# EAGLE schematic samd21g_board (EAGLE 9.6.2)

## Sheet 1 of 2
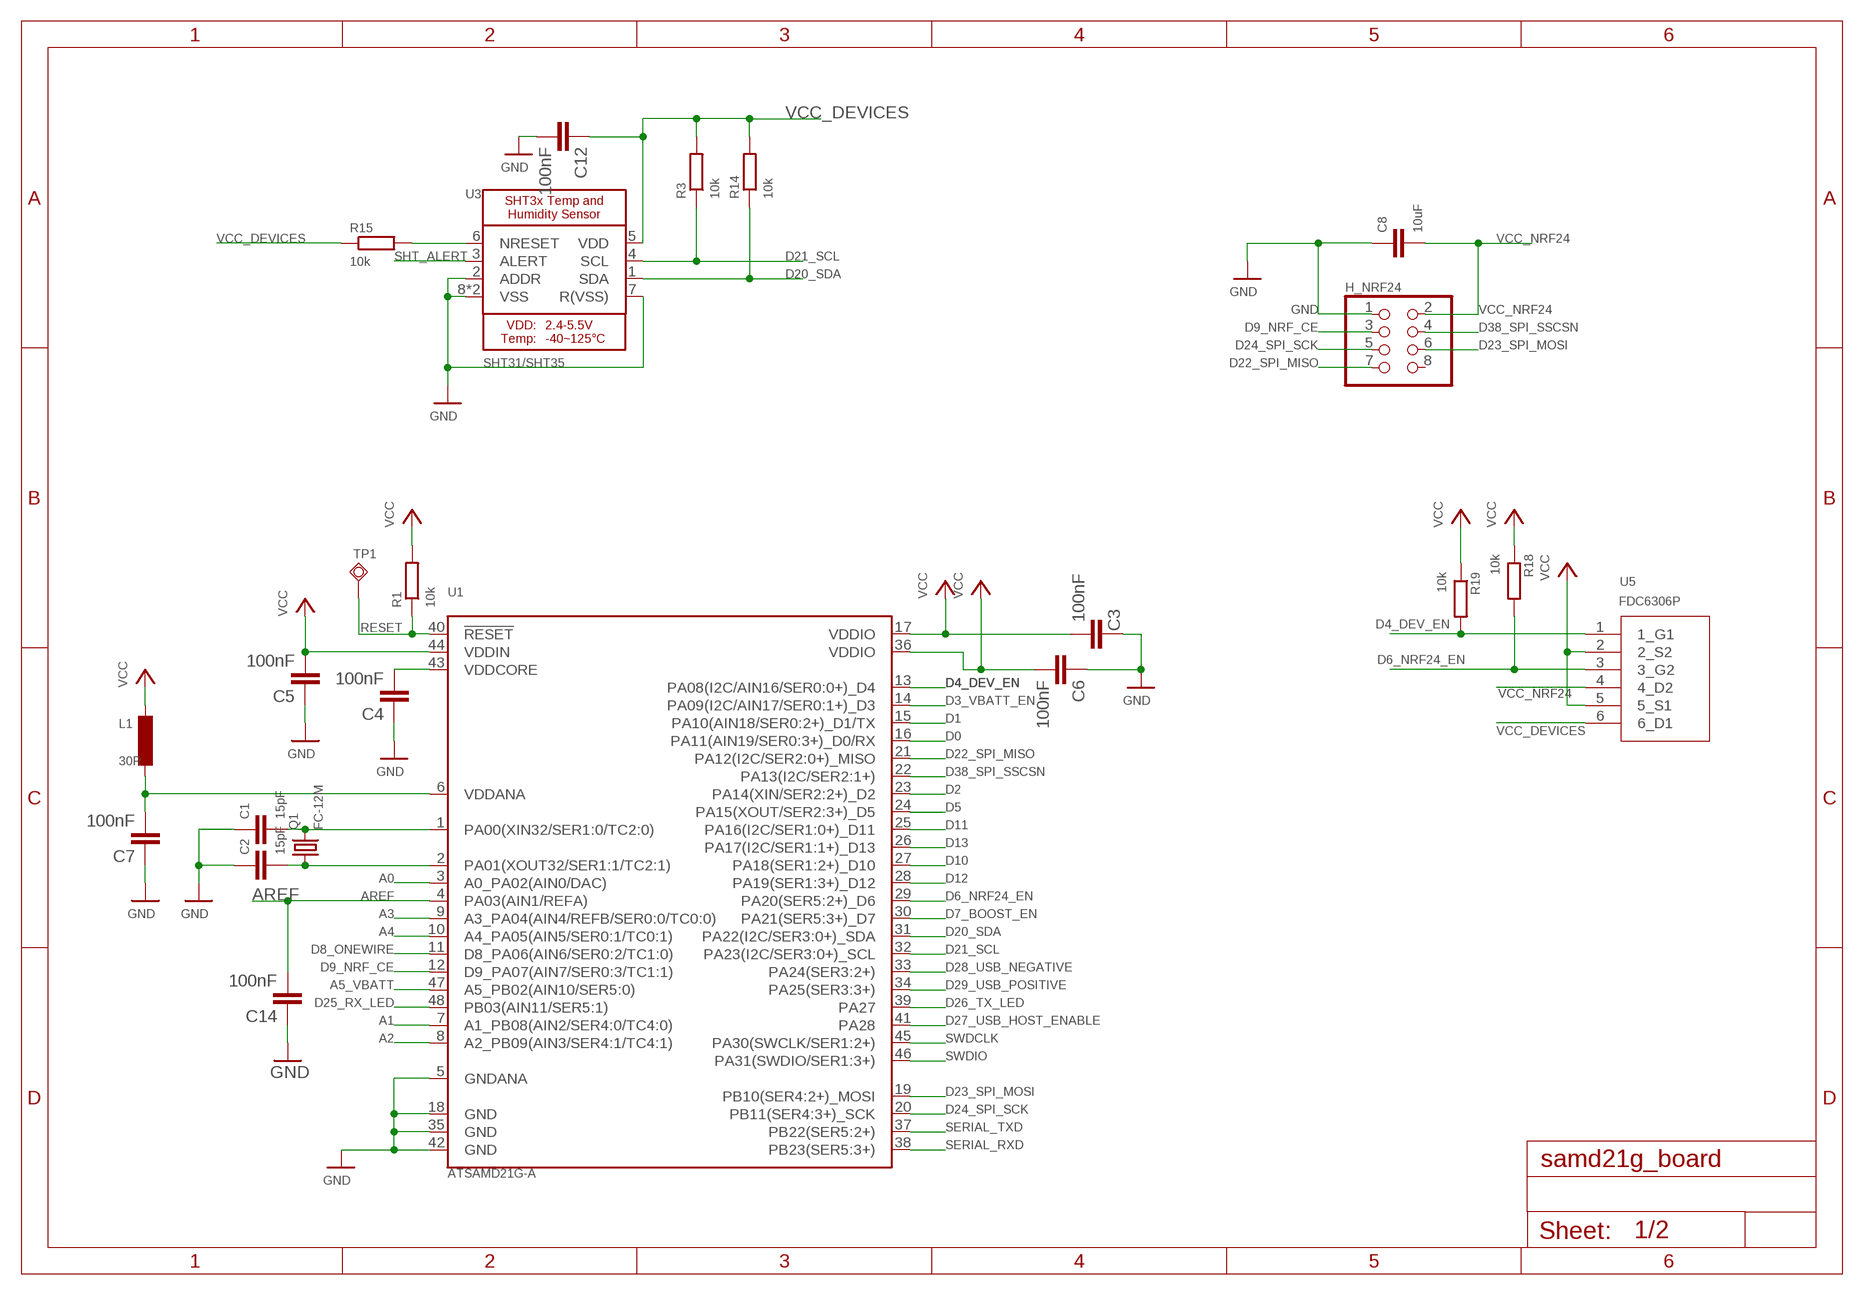
[diagram p0: schematic, sheet 1]

### Parts
C1  15pF  C-EUC0402  [C0402]
C2  15pF  C-EUC0402  [C0402]
C3  100nF  C-EUC0603  [C0603]
C4  100nF  C-EUC0603  [C0603]
C5  100nF  C-EUC0603  [C0603]
C6  100nF  C-EUC0603  [C0603]
C7  100nF  C-EUC0603  [C0603]
C8  10uF  C-EUC0805  [C0805]
C12  100nF  C-EUC0603  [C0603]
C14  100nF  C-EUC0603  [C0603]
H_NRF24  PINHD-2X04_2.54  [2X04]
L1  30R  L-EUL3225M  [L3225M]
Q1  FC-12M  [FC-12M]
R1  10k  R-EU_R0805  [R0805]
R3  10k  R-EU_R0805  [R0805]
R14  10k  R-EU_R0805  [R0805]
R15  10k  R-EU_R0805  [R0805]
R18  10k  R-EU_R0805  [R0805]
R19  10k  R-EU_R0805  [R0805]
TP1  TPSQTP13SQ  [TP13SQ]
U1  ATSAMD21G-A  [TQFP-48]
U3  SHT31/SHT35  SHT3X  [SHT3X_DFN8]
U5  FDC6306P  [TSOT23-6_419BL_ONS]

### Nets
A0: U1.3(A0_PA02(AIN0/DAC)) ; also sheet 2
A1: U1.7(A1_PB08(AIN2/SER4:0/TC4:0)) ; also sheet 2
A2: U1.8(A2_PB09(AIN3/SER4:1/TC4:1)) ; also sheet 2
A3: U1.9(A3_PA04(AIN4/REFB/SER0:0/TC0:0)) ; also sheet 2
A4: U1.10(A4_PA05(AIN5/SER0:1/TC0:1)) ; also sheet 2
A5_VBATT: U1.47(A5_PB02(AIN10/SER5:0)) ; also sheet 2
AREF: C14.2 U1.4(PA03(AIN1/REFA)) ; also sheet 2
D0: U1.16(PA11(AIN19/SER0:3+)_D0/RX) ; also sheet 2
D1: U1.15(PA10(AIN18/SER0:2+)_D1/TX) ; also sheet 2
D2: U1.23(PA14(XIN/SER2:2+)_D2) ; also sheet 2
D3_VBATT_EN: U1.14(PA09(I2C/AIN17/SER0:1+)_D3) ; also sheet 2
D4_DEV_EN: R19.2 U1.13(PA08(I2C/AIN16/SER0:0+)_D4) U5.1(1_G1)
D5: U1.24(PA15(XOUT/SER2:3+)_D5) ; also sheet 2
D6_NRF24_EN: R18.2 U1.29(PA20(SER5:2+)_D6) U5.3(3_G2)
D7_BOOST_EN: U1.30(PA21(SER5:3+)_D7) ; also sheet 2
D8_ONEWIRE: U1.11(D8_PA06(AIN6/SER0:2/TC1:0)) ; also sheet 2
D9_NRF_CE: H_NRF24.3 U1.12(D9_PA07(AIN7/SER0:3/TC1:1))
D10: U1.27(PA18(SER1:2+)_D10) ; also sheet 2
D11: U1.25(PA16(I2C/SER1:0+)_D11) ; also sheet 2
D12: U1.28(PA19(SER1:3+)_D12) ; also sheet 2
D13: U1.26(PA17(I2C/SER1:1+)_D13) ; also sheet 2
D20_SDA: R14.1 U1.31(PA22(I2C/SER3:0+)_SDA) U3.1(SDA) ; also sheet 2
D21_SCL: R3.1 U1.32(PA23(I2C/SER3:0+)_SCL) U3.4(SCL) ; also sheet 2
D22_SPI_MISO: H_NRF24.7 U1.21(PA12(I2C/SER2:0+)_MISO) ; also sheet 2
D23_SPI_MOSI: H_NRF24.6 U1.19(PB10(SER4:2+)_MOSI) ; also sheet 2
D24_SPI_SCK: H_NRF24.5 U1.20(PB11(SER4:3+)_SCK) ; also sheet 2
D25_RX_LED: U1.48(PB03(AIN11/SER5:1)) ; also sheet 2
D26_TX_LED: U1.39(PA27) ; also sheet 2
D27_USB_HOST_ENABLE: U1.41(PA28) ; also sheet 2
D28_USB_NEGATIVE: U1.33(PA24(SER3:2+)) ; also sheet 2
D29_USB_POSITIVE: U1.34(PA25(SER3:3+)) ; also sheet 2
D38_SPI_SSCSN: H_NRF24.4 U1.22(PA13(I2C/SER2:1+)) ; also sheet 2
GND [vcc]: C1.1 C2.1 C3.1 C4.1 C5.1 C6.1 C7.1 C8.1 C12.2 C14.1 H_NRF24.1 U1.5(GNDANA) U1.18(GND) U1.35(GND) U1.42(GND) U3.2(ADDR) U3.7(R(VSS)) U3.8(VSS) U3.THERMAL(VSS) ; also sheet 2
N$1: C1.2 Q1.2 U1.1(PA00(XIN32/SER1:0/TC2:0))
N$2: C2.2 Q1.1 U1.2(PA01(XOUT32/SER1:1/TC2:1))
N$5: R15.2 U3.6(NRESET)
N$9: C7.2 L1.2 U1.6(VDDANA)
N$32: C4.2 U1.43(VDDCORE)
RESET: R1.1 TP1.TP U1.40(!RESET!) ; also sheet 2
SERIAL_RXD: U1.38(PB23(SER5:3+)) ; also sheet 2
SERIAL_TXD: U1.37(PB22(SER5:2+)) ; also sheet 2
SHT_ALERT: U3.3(ALERT) ; also sheet 2
SWDCLK: U1.45(PA30(SWCLK/SER1:2+)) ; also sheet 2
SWDIO: U1.46(PA31(SWDIO/SER1:3+)) ; also sheet 2
VCC [vcc]: C3.2 C5.2 C6.2 L1.1 R1.2 R18.1 R19.1 U1.17(VDDIO) U1.36(VDDIO) U1.44(VDDIN) U5.2(2_S2) U5.5(5_S1) ; also sheet 2
VCC_DEVICES [vcc]: C12.1 R3.2 R14.2 R15.1 U3.5(VDD) U5.6(6_D1) ; also sheet 2
VCC_NRF24 [vcc]: C8.2 H_NRF24.2 U5.4(4_D2)
Unconnected: H_NRF24.8

## Sheet 2 of 2: power
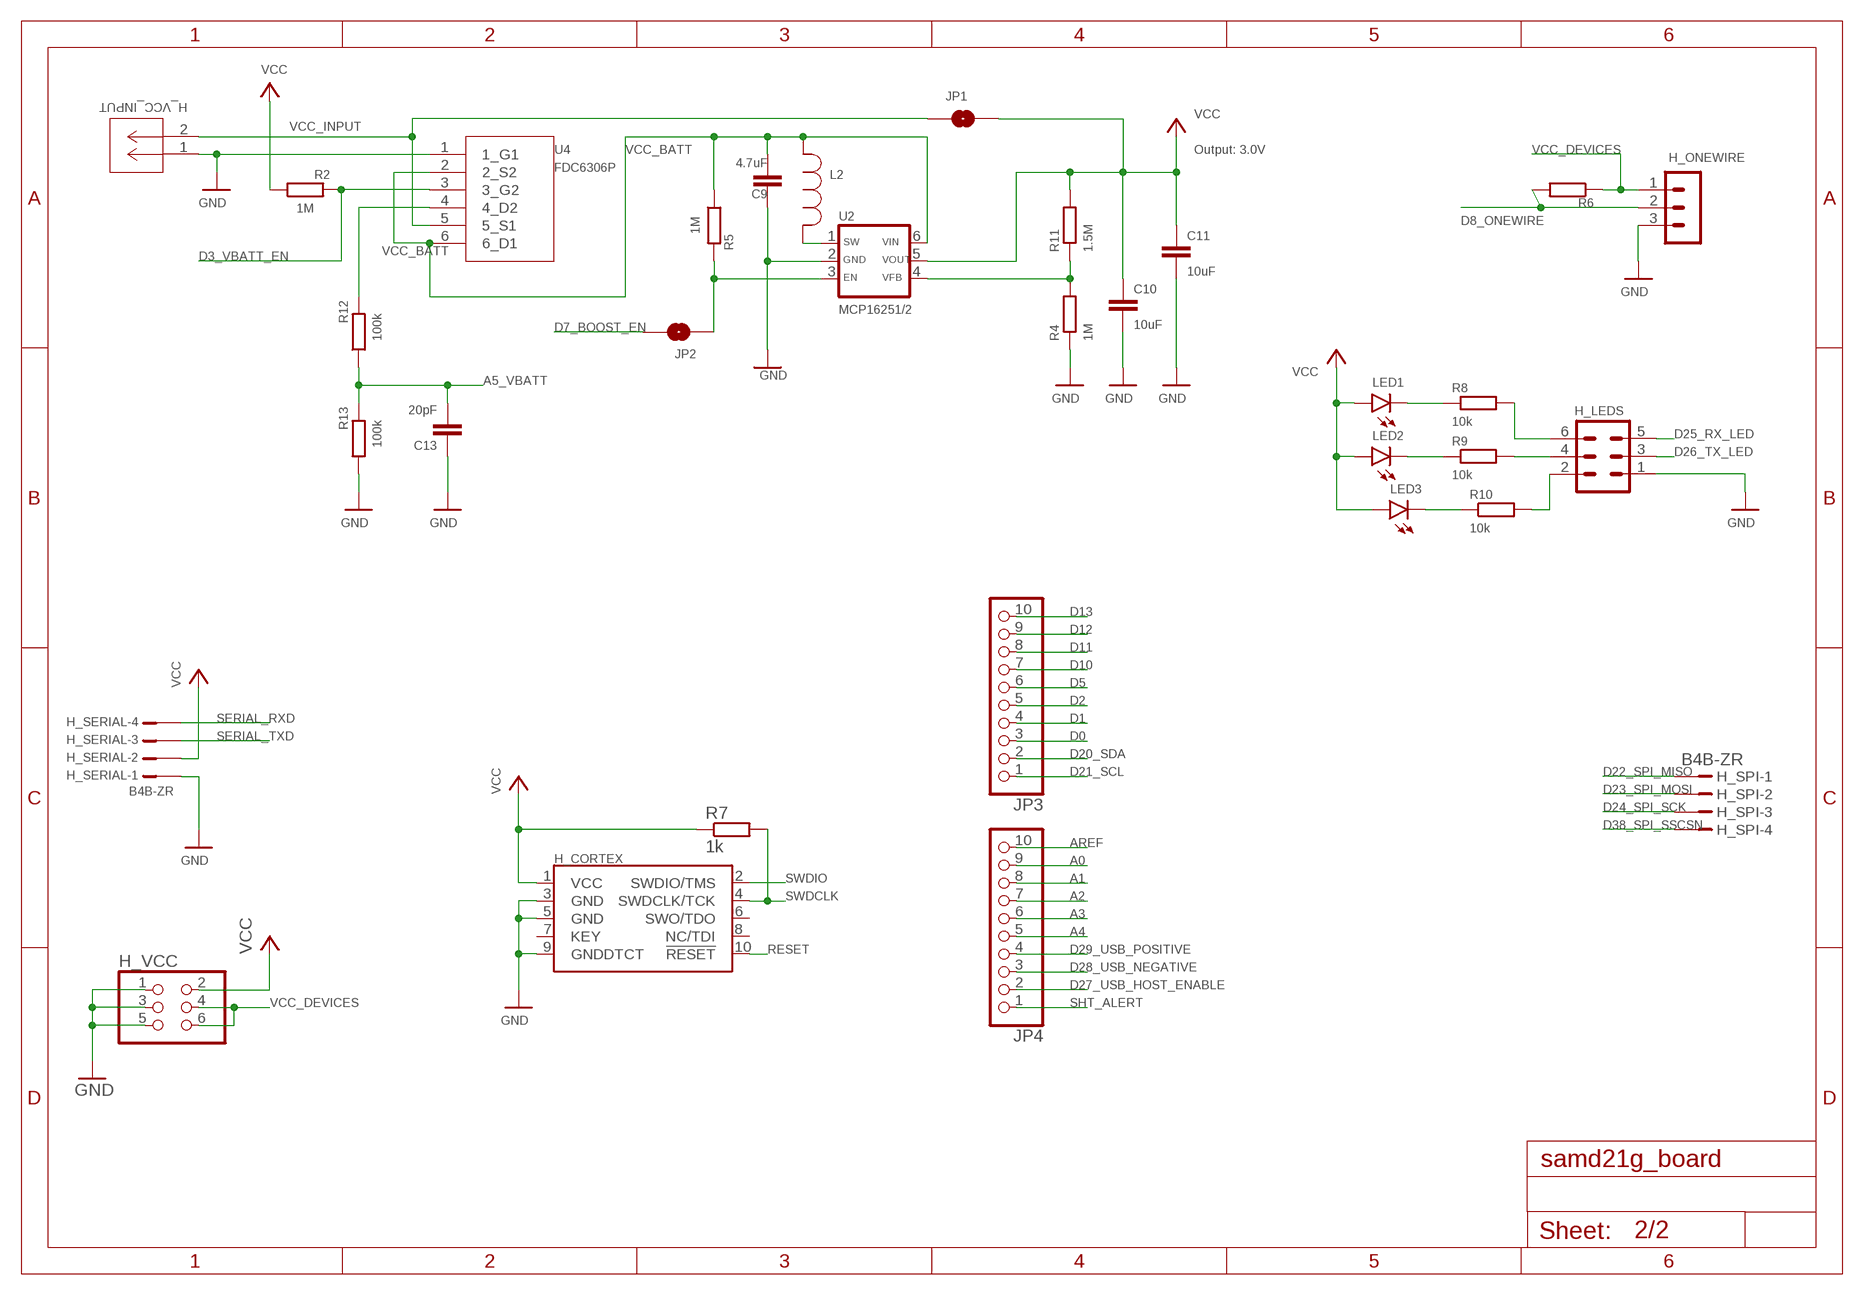
[diagram p1: schematic, sheet 2]

### Parts
C9  4.7uF  C-EUC0805  [C0805]
C10  10uF  C-EUC0805  [C0805]
C11  10uF  C-EUC0805  [C0805]
C13  20pF  C-EUC0402  [C0402]
H_CORTEX  CORTEX_JTAG_DEBUG_PTH  [2X5-PTH-1.27MM]
H_LEDS  M_2R03_50MIL-V2  [M_2R03_50MIL-V2]
H_ONEWIRE  M_1R03_50MIL-V  [M_1R03_50MIL-V]
H_SERIAL  B4B-ZR  [B4B-ZR]
H_SPI  B4B-ZR  [B4B-ZR]
H_VCC  PINHD-2X03_2.54  [2X03]
H_VCC_INPUT  S2B-ZR  S2B-ZR(LF)(SN)  [CONN_S2B-ZR_JST]
JP1  JUMPER-SMT_2_NO_NO-SILK  [SMT-JUMPER_2_NO_NO-SILK]
JP2  JUMPER-SMT_2_NO_NO-SILK  [SMT-JUMPER_2_NO_NO-SILK]
JP3  PINHD-1X10_2.54-S  [1X10-S]
JP4  PINHD-1X10_2.54-S  [1X10-S]
L2  4.7uH  CDRH3D16-4R7NC  [IND_CDRH3D16-4R7NC_SUM]
LED1  LEDCHIP-LED0805  [CHIP-LED0805]
LED2  LEDCHIP-LED0805  [CHIP-LED0805]
LED3  LEDCHIP-LED0805  [CHIP-LED0805]
R2  1M  R-EU_R0805  [R0805]
R4  1M  R-EU_R0805  [R0805]
R5  1M  R-EU_R0805  [R0805]
R6  4.7k  R-EU_R0805  [R0805]
R7  1k  R-EU_R0805  [R0805]
R8  10k  R-EU_R0805  [R0805]
R9  10k  R-EU_R0805  [R0805]
R10  10k  R-EU_R0805  [R0805]
R11  1.5M  R-EU_R0805  [R0805]
R12  100k  R-EU_R0805  [R0805]
R13  100k  R-EU_R0805  [R0805]
U2  MCP16251/2  [SOT-23-6]
U4  FDC6306P  [TSOT23-6_419BL_ONS]

### Nets
A0: JP4.9 ; also sheet 1
A1: JP4.8 ; also sheet 1
A2: JP4.7 ; also sheet 1
A3: JP4.6 ; also sheet 1
A4: JP4.5 ; also sheet 1
A5_VBATT: C13.2 R12.1 R13.2 ; also sheet 1
AREF: JP4.10 ; also sheet 1
D0: JP3.3 ; also sheet 1
D1: JP3.4 ; also sheet 1
D2: JP3.5 ; also sheet 1
D3_VBATT_EN: R2.2 U4.3(3_G2) ; also sheet 1
D5: JP3.6 ; also sheet 1
D7_BOOST_EN: JP2.2 ; also sheet 1
D8_ONEWIRE: H_ONEWIRE.2 R6.2 ; also sheet 1
D10: JP3.7 ; also sheet 1
D11: JP3.8 ; also sheet 1
D12: JP3.9 ; also sheet 1
D13: JP3.10 ; also sheet 1
D20_SDA: JP3.2 ; also sheet 1
D21_SCL: JP3.1 ; also sheet 1
D22_SPI_MISO: H_SPI.1 ; also sheet 1
D23_SPI_MOSI: H_SPI.2 ; also sheet 1
D24_SPI_SCK: H_SPI.3 ; also sheet 1
D25_RX_LED: H_LEDS.5 ; also sheet 1
D26_TX_LED: H_LEDS.3 ; also sheet 1
D27_USB_HOST_ENABLE: JP4.2 ; also sheet 1
D28_USB_NEGATIVE: JP4.3 ; also sheet 1
D29_USB_POSITIVE: JP4.4 ; also sheet 1
D38_SPI_SSCSN: H_SPI.4 ; also sheet 1
GND [vcc]: C9.1 C10.2 C11.2 C13.1 H_CORTEX.3(GND) H_CORTEX.5(GND) H_CORTEX.9(GNDDTCT) H_LEDS.1 H_ONEWIRE.3 H_SERIAL.1 H_VCC.1 H_VCC.3 H_VCC.5 H_VCC_INPUT.1 R4.1 R13.1 U2.2(GND) U4.1(1_G1) ; also sheet 1
N$3: H_LEDS.4 R9.2
N$4: LED2.C R9.1
N$6: LED3.C R10.1
N$7: LED1.C R8.1
N$8: H_LEDS.6 R8.2
N$10: JP2.1 R5.2 U2.3(EN)
N$11: R12.2 U4.4(4_D2)
N$12: H_LEDS.2 R10.2
N$13: R4.2 R11.1 U2.4(VFB)
N$14: L2.1 U2.1(SW)
RESET: H_CORTEX.10(!RESET) ; also sheet 1
SERIAL_RXD: H_SERIAL.4 ; also sheet 1
SERIAL_TXD: H_SERIAL.3 ; also sheet 1
SHT_ALERT: JP4.1 ; also sheet 1
SWDCLK: H_CORTEX.4(SWDCLK/TCK) R7.2 ; also sheet 1
SWDIO: H_CORTEX.2(SWDIO/TMS) ; also sheet 1
VCC [vcc]: C10.1 C11.1 H_CORTEX.1(VCC) H_SERIAL.2 H_VCC.2 JP1.2 LED1.A LED2.A LED3.A R2.1 R7.1 R11.2 U2.5(VOUT) ; also sheet 1
VCC_BATT [vcc]: C9.2 L2.2 R5.1 U2.6(VIN) U4.2(2_S2) U4.6(6_D1)
VCC_DEVICES [vcc]: H_ONEWIRE.1 H_VCC.4 H_VCC.6 R6.1 ; also sheet 1
VCC_INPUT [vcc]: H_VCC_INPUT.2 JP1.1 U4.5(5_S1)
Unconnected: H_CORTEX.6(SWO/TDO) H_CORTEX.7(KEY) H_CORTEX.8(NC/TDI)

### Notes on the sheet
- Output: 3.0V

## Library data of the parts
C1 C2 = rcl:C-EU: CAPACITOR, European symbol; SOPL_MPN: GRM1555C1H150JA01D; SOPL_SKU: 302010041; SPICEPREFIX: C
C3-C7 C12 C14 = rcl:C-EU: CAPACITOR, European symbol; SOPL_MPN: CC0603KRX7R9BB104; SOPL_SKU: 302010138; SPICEPREFIX: C
C8 C10 C11 = rcl:C-EU: CAPACITOR, European symbol; SOPL_MPN: CC0805KKX5R8BB106; SOPL_SKU: 302010178; SPICEPREFIX: C
C9 C13 = rcl:C-EU: CAPACITOR, European symbol; SOPL_MPN: CC0805KKX5R8BB475; SOPL_SKU: 302010146; SPICEPREFIX: C
H_CORTEX = SparkFun-Connectors:CORTEX_JTAG_DEBUG: Cortex Debug Connector - 10 pin Supports JTAG debug, Serial Wire debug, and Serial Wire Viewer. PTH and SMD connector options available. General Connector Information <http://infocenter.arm.com/help/topic/com.arm.doc.faqs/attached/13634/cortex_debug_connectors.pdf> Products: PTH Connector <http://www.digikey.com/product-detail/en/cnc-tech/3220-10-0100-00/1175-1627-ND/3883661> -via Digi-Key SparkFun PSoc <https://www.sparkfun.com/products/13229> SparkFun T <https://www.sparkfun.com/products/13810>; SPICEPREFIX: X
H_LEDS = common_used_objects:M_2R03: Pin header, male, 2 rows
H_NRF24 = common_used_objects:PINHD-2X04: PIN HEADER
H_ONEWIRE = common_used_objects:M_1R03: Pin header, male, 1 row
H_SERIAL H_SPI = con-jst:?4B-ZR: ZH CONNECTOR 1.5 mm, 4 pin 1 row Source: http://www.jst.com .. eZH.pdf; MF: FARNELL; MPN: B4B-ZR(LF)(SN); OC_FARNELL: 1830916; OC_NEWARK: 37K9960
H_VCC = common_used_objects:PINHD-2X03: PIN HEADER
H_VCC_INPUT = common_used_objects:S2B-ZR(LF)(SN); BUILT_BY: EMA_Justin; COPYRIGHT: Copyright (C) 2018 Accelerated Designs. All rights reserved; DATASHEET: http://www.jst-mfg.com/product/pdf/eng/eZH.pdf; MANUFACTURER_PART_NUMBER: S2B-ZR(LF)(SN); SOURCELIBRARY: JST_2020-03-24; VENDOR: JST
JP1 JP2 = common_used_objects:JUMPER-SMT_2_NO: Normally open jumper This jumper has two pads in close proximity to each other. Apply solder to close the connection. Round pads are easier to solder for beginners, but are a lot larger. SparkFun Product that uses the round pads: SparkFun EL Sequencer <https://www.sparkfun.com/products/12781>
JP3 JP4 = common_used_objects:PINHD-1X10: PIN HEADER
L1 = rcl:L-EU: INDUCTOR, European symbol; SPICEPREFIX: L
L2 = common_used_objects:CDRH3D16-4R7NC; BUILT_BY: EMA_Cory; COPYRIGHT: Copyright (C) 2018 Accelerated Designs. All rights reserved; MANUFACTURER_PART_NUMBER: CDRH3D16/HPNP-4R7NC; SOPL_MPN: VLS201610HBX-4R7M-1; SOPL_SKU: 303010544; SOURCELIBRARY: Sumida_2020-01-16; VALUE_: 4.7uH; VENDOR: Sumida
LED1 = led:LED: LED OSRAM: - CHIPLED LG R971, LG N971, LY N971, LG Q971, LY Q971, LO R971, LY R971 LH N974, LH R974 LS Q976, LO Q976, LY Q976 LO Q996 - Hyper CHIPLED LW Q18S LB Q993, LB Q99A, LB R99A - SideLED LS A670, LO A670, LY A670, LG A670, LP A670 LB A673, LV A673, LT A673, LW A673 LH A674 LY A675 LS A676, LA A676, LO A676, LY A676, LW A676 LS A679, LY A679, LG A679 - Hyper Micro SIDELED® LS Y876, LA Y876, LO Y876, LY Y876 LT Y87S - SmartLED LW L88C, LW L88S LB L89C, LB L89S, LG L890 LS L89K, LO L89K, LY L89K LS L896, LA L896, LO L896, LY L896 - TOPLED LS T670, LO T670, LY T670, LG T670, LP T670 LSG T670, LSP T670, LSY T670, LOP T670, LYG T670 LG T671, LOG T671, LSG T671 LB T673, LV T673, LT T673, LW T673 LH T674 LS T676, LA T676, LO T676, LY T676, LB T676, LH T676, LSB T676, LW T676 LB T67C, LV T67C, LT T67C, LS T67K, LO T67K, LY T67K, LW E67C LS E67B, LA E67B, LO E67B, LY E67B, LB E67C, LV E67C, LT E67C LW T67C LS T679, LY T679, LG T679 LS T770, LO T770, LY T770, LG T770, LP T770 LB T773, LV T773, LT T773, LW T773 LH T774 LS E675, LA E675, LY E675, LS T675 LS T776, LA T776, LO T776, LY T776, LB T776 LHGB T686 LT T68C, LB T68C - Hyper Mini TOPLED® LB M676 - Mini TOPLED Santana® LG M470 LS M47K, LO M47K, LY M47K Source: http://www.osram.convergy.de LUXEON: - LUMILED® LXK2-PW12-R00, LXK2-PW12-S00, LXK2-PW14-U00, LXK2-PW14-V00 LXK2-PM12-R00, LXK2-PM12-S00, LXK2-PM14-U00 LXK2-PE12-Q00, LXK2-PE12-R00, LXK2-PE12-S00, LXK2-PE14-T00, LXK2-PE14-U00 LXK2-PB12-K00, LXK2-PB12-L00, LXK2-PB12-M00, LXK2-PB14-N00, LXK2-PB14-P00, LXK2-PB14-Q00 LXK2-PR12-L00, LXK2-PR12-M00, LXK2-PR14-Q00, LXK2-PR14-R00 LXK2-PD12-Q00, LXK2-PD12-R00, LXK2-PD12-S00 LXK2-PH12-R00, LXK2-PH12-S00 LXK2-PL12-P00, LXK2-PL12-Q00, LXK2-PL12-R00 Source: www.luxeon.com KINGBRIGHT: KA-3528ASYC Source: www.kingbright.com; SOPL_MPN: 17-215SYGC/S530-E2/TR8; SOPL_SKU: 304090057
LED2 = led:LED: LED OSRAM: - CHIPLED LG R971, LG N971, LY N971, LG Q971, LY Q971, LO R971, LY R971 LH N974, LH R974 LS Q976, LO Q976, LY Q976 LO Q996 - Hyper CHIPLED LW Q18S LB Q993, LB Q99A, LB R99A - SideLED LS A670, LO A670, LY A670, LG A670, LP A670 LB A673, LV A673, LT A673, LW A673 LH A674 LY A675 LS A676, LA A676, LO A676, LY A676, LW A676 LS A679, LY A679, LG A679 - Hyper Micro SIDELED® LS Y876, LA Y876, LO Y876, LY Y876 LT Y87S - SmartLED LW L88C, LW L88S LB L89C, LB L89S, LG L890 LS L89K, LO L89K, LY L89K LS L896, LA L896, LO L896, LY L896 - TOPLED LS T670, LO T670, LY T670, LG T670, LP T670 LSG T670, LSP T670, LSY T670, LOP T670, LYG T670 LG T671, LOG T671, LSG T671 LB T673, LV T673, LT T673, LW T673 LH T674 LS T676, LA T676, LO T676, LY T676, LB T676, LH T676, LSB T676, LW T676 LB T67C, LV T67C, LT T67C, LS T67K, LO T67K, LY T67K, LW E67C LS E67B, LA E67B, LO E67B, LY E67B, LB E67C, LV E67C, LT E67C LW T67C LS T679, LY T679, LG T679 LS T770, LO T770, LY T770, LG T770, LP T770 LB T773, LV T773, LT T773, LW T773 LH T774 LS E675, LA E675, LY E675, LS T675 LS T776, LA T776, LO T776, LY T776, LB T776 LHGB T686 LT T68C, LB T68C - Hyper Mini TOPLED® LB M676 - Mini TOPLED Santana® LG M470 LS M47K, LO M47K, LY M47K Source: http://www.osram.convergy.de LUXEON: - LUMILED® LXK2-PW12-R00, LXK2-PW12-S00, LXK2-PW14-U00, LXK2-PW14-V00 LXK2-PM12-R00, LXK2-PM12-S00, LXK2-PM14-U00 LXK2-PE12-Q00, LXK2-PE12-R00, LXK2-PE12-S00, LXK2-PE14-T00, LXK2-PE14-U00 LXK2-PB12-K00, LXK2-PB12-L00, LXK2-PB12-M00, LXK2-PB14-N00, LXK2-PB14-P00, LXK2-PB14-Q00 LXK2-PR12-L00, LXK2-PR12-M00, LXK2-PR14-Q00, LXK2-PR14-R00 LXK2-PD12-Q00, LXK2-PD12-R00, LXK2-PD12-S00 LXK2-PH12-R00, LXK2-PH12-S00 LXK2-PL12-P00, LXK2-PL12-Q00, LXK2-PL12-R00 Source: www.luxeon.com KINGBRIGHT: KA-3528ASYC Source: www.kingbright.com; SOPL_MPN: 17-215SURC/S530-A2/TR8; SOPL_SKU: 304090046
LED3 = led:LED: LED OSRAM: - CHIPLED LG R971, LG N971, LY N971, LG Q971, LY Q971, LO R971, LY R971 LH N974, LH R974 LS Q976, LO Q976, LY Q976 LO Q996 - Hyper CHIPLED LW Q18S LB Q993, LB Q99A, LB R99A - SideLED LS A670, LO A670, LY A670, LG A670, LP A670 LB A673, LV A673, LT A673, LW A673 LH A674 LY A675 LS A676, LA A676, LO A676, LY A676, LW A676 LS A679, LY A679, LG A679 - Hyper Micro SIDELED® LS Y876, LA Y876, LO Y876, LY Y876 LT Y87S - SmartLED LW L88C, LW L88S LB L89C, LB L89S, LG L890 LS L89K, LO L89K, LY L89K LS L896, LA L896, LO L896, LY L896 - TOPLED LS T670, LO T670, LY T670, LG T670, LP T670 LSG T670, LSP T670, LSY T670, LOP T670, LYG T670 LG T671, LOG T671, LSG T671 LB T673, LV T673, LT T673, LW T673 LH T674 LS T676, LA T676, LO T676, LY T676, LB T676, LH T676, LSB T676, LW T676 LB T67C, LV T67C, LT T67C, LS T67K, LO T67K, LY T67K, LW E67C LS E67B, LA E67B, LO E67B, LY E67B, LB E67C, LV E67C, LT E67C LW T67C LS T679, LY T679, LG T679 LS T770, LO T770, LY T770, LG T770, LP T770 LB T773, LV T773, LT T773, LW T773 LH T774 LS E675, LA E675, LY E675, LS T675 LS T776, LA T776, LO T776, LY T776, LB T776 LHGB T686 LT T68C, LB T68C - Hyper Mini TOPLED® LB M676 - Mini TOPLED Santana® LG M470 LS M47K, LO M47K, LY M47K Source: http://www.osram.convergy.de LUXEON: - LUMILED® LXK2-PW12-R00, LXK2-PW12-S00, LXK2-PW14-U00, LXK2-PW14-V00 LXK2-PM12-R00, LXK2-PM12-S00, LXK2-PM14-U00 LXK2-PE12-Q00, LXK2-PE12-R00, LXK2-PE12-S00, LXK2-PE14-T00, LXK2-PE14-U00 LXK2-PB12-K00, LXK2-PB12-L00, LXK2-PB12-M00, LXK2-PB14-N00, LXK2-PB14-P00, LXK2-PB14-Q00 LXK2-PR12-L00, LXK2-PR12-M00, LXK2-PR14-Q00, LXK2-PR14-R00 LXK2-PD12-Q00, LXK2-PD12-R00, LXK2-PD12-S00 LXK2-PH12-R00, LXK2-PH12-S00 LXK2-PL12-P00, LXK2-PL12-Q00, LXK2-PL12-R00 Source: www.luxeon.com KINGBRIGHT: KA-3528ASYC Source: www.kingbright.com; SOPL_MPN: 17-215UYC/S530-A3/TR8; SOPL_SKU: 304090039
Q1 = crystal:FC-12M: kHz RANGE CRYSTAL UNIT LOW PROFILE SMD Source: Epson Toyocom FC-12M.pdf; SOPL_MPN: FC-12M; SOPL_SKU: 306010020
R1 R3 R8-R10 R14 R15 R18 R19 = rcl:R-EU_: RESISTOR, European symbol; SOPL_MPN: RC0805FR-0710KL; SOPL_SKU: 301010361; SPICEPREFIX: R
R2 R4 R5 R12 R13 = rcl:R-EU_: RESISTOR, European symbol; SOPL_MPN: RC0805FR-071ML; SOPL_SKU: 301012157; SPICEPREFIX: R
R6 = rcl:R-EU_: RESISTOR, European symbol; SOPL_MPN: RC0603FR-074K7L; SOPL_SKU: 301010195; SPICEPREFIX: R
R7 = rcl:R-EU_: RESISTOR, European symbol; SOPL_MPN: 301010311; SOPL_SKU: RC0805JR-071KL; SPICEPREFIX: R
R11 = rcl:R-EU_: RESISTOR, European symbol; SOPL_MPN: RC0805JR-071M5L; SPICEPREFIX: R; TME: SMD0805-1M5-1%
TP1 = testpad:TPSQ: Test pad
U1 = common_used_objects:ATSAMD21G: Atmel SAMD21G SMART ARM-Based Microcontroller The Atmel ® | SMART ™ SAM D21 is a series of low-power microcontrollers using the 32-bit ARM ® Cortex ® -M0+ processor, and ranging from 32- to 64-pins with up to 256KB Flash and 32KB of SRAM. The SAM D21 devices operate at a maximum frequency of 48MHz and reach 2.46 CoreMark/MHz. They are designed for simple and intuitive migration with identical peripheral modules, hex compatible code, identical linear address map and pin compatible migration paths between all devices in the product series. All devices include intelligent and flexible peripherals, Atmel Event System for inter-peripheral signaling, and support for capacitive touch button, slider and wheel user interfaces. Datasheet <https://cdn.sparkfun.com/datasheets/Dev/Arduino/Boards/Atmel-42181-SAM-D21_Datasheet.pdf> SparkFun Products SparkFun SAMD21 Mini Breakout <https://www.sparkfun.com/products/13664> (DEV-13664) SparkFun SAMD21 Dev Breakout <https://www.sparkfun.com/products/13672> (DEV-13672) (DEV-14926); PROD_ID: IC-13064; SOPL_MPN: ATSAMD21G18A-MU; SOPL_SKU: 310010095
U2 = MCP16251-2:MCP16251/2
U3 = common_used_objects:SHT3X: SHT3x - Digital Temperature and Humidity Sensor Supply Voltage: 2.4-5.5V Humidity Accuracy: SHT30 = +/-3%RH, SHT31 = +/-2%RH Temperature Sensor: -40~125°C (+/-0.3°C from 10-55C); SOPL_MPN: SHT35-DIS-B/SHT31-DIS-B
U4 U5 = common_used_objects:FDC6306P; BUILT_BY: EMA_Cory; COPYRIGHT: Copyright (C) 2018 Accelerated Designs. All rights reserved; DATASHEET: https://www.onsemi.com/pub/Collateral/FDC6306P-D.pdf; MANUFACTURER_PART_NUMBER: FDC6306P; SOURCELIBRARY: Add_to_database_2020-12-23; VENDOR: ON Semiconductor

## Net classes
1 vcc: width 0.203 mm